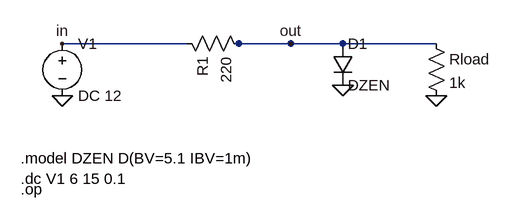
[diagram p0: schematic zener_regulator_dc.asc]
zener_regulator_dc.asc, the LTspice schematic file:
Version 4
SHEET 1 1500 950
WIRE 112 176 304 176
WIRE 384 176 544 176
WIRE 384 176 688 176
WIRE 384 176 464 176
FLAG 112 176 in
FLAG 464 176 out
FLAG 112 256 0
FLAG 544 240 0
FLAG 688 256 0
SYMBOL voltage 112 160 R0
SYMATTR InstName V1
SYMATTR Value DC 12
SYMBOL res 288 160 M90
SYMATTR InstName R1
SYMATTR Value 220
SYMBOL diode 528 176 R0
SYMATTR InstName D1
SYMATTR Value DZEN
SYMBOL res 672 160 R0
SYMATTR InstName Rload
SYMATTR Value 1k
TEXT 48 352 Left 2 !.model DZEN D(BV=5.1 IBV=1m)
TEXT 48 384 Left 2 !.dc V1 6 15 0.1
TEXT 48 400 Left 2 !.op

The netlist it stands for:
* zener_regulator_dc.asc
V1 in 0 DC 12
R1 in out 220
D1 out 0 DZEN
Rload out 0 1k
.model D D
.lib standard.dio
.model DZEN D(BV=5.1 IBV=1m)
.dc V1 6 15 0.1
.op
.backanno
.end